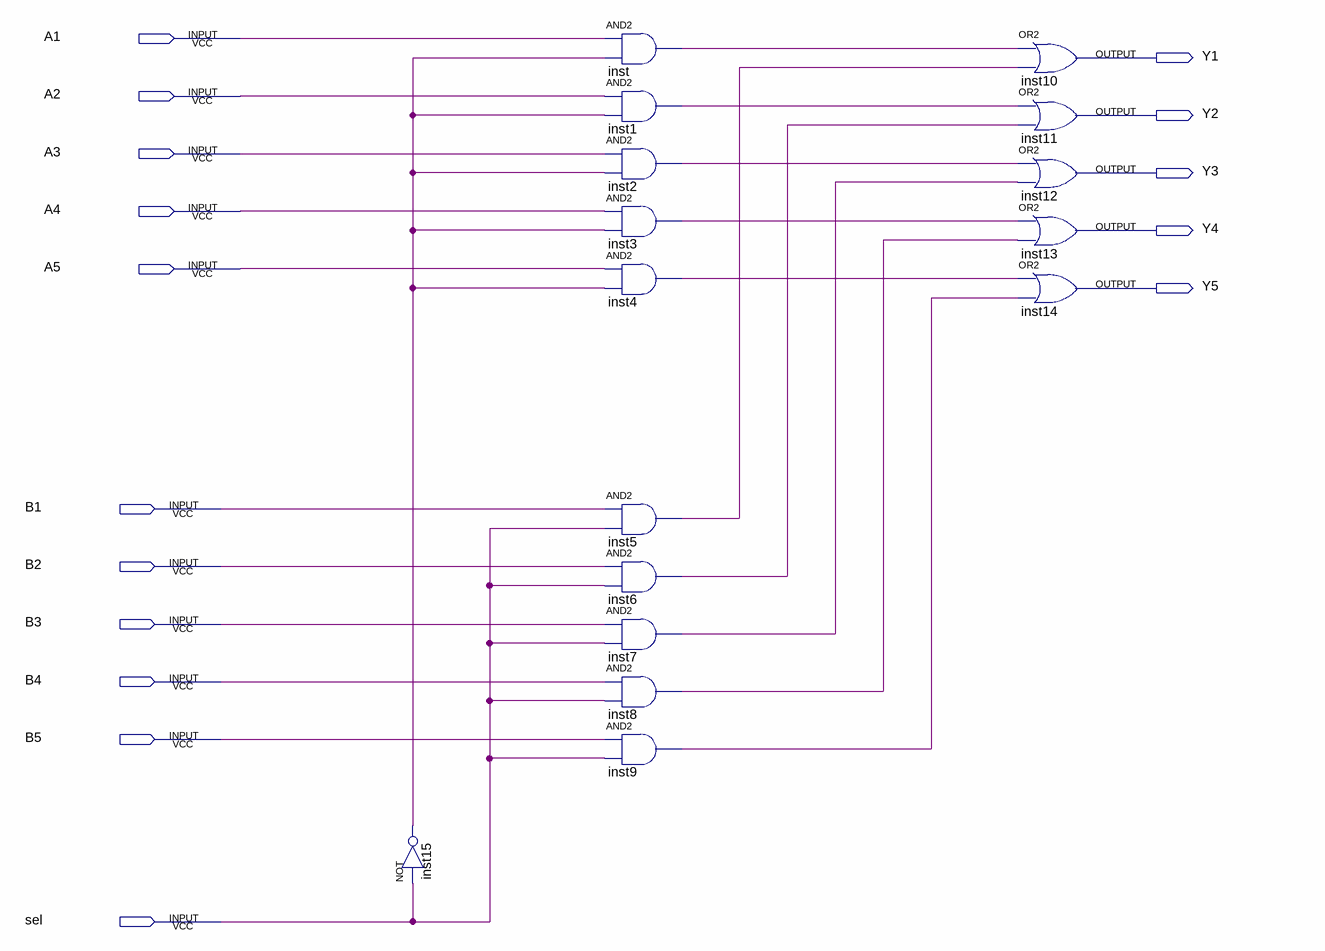
[diagram p0: schematic sheet]
// Quartus schematic 10sel5.bdf as structural Verilog: 16 symbols, 16 pins
module \10sel5  (
  input  A1,
  input  A2,
  input  A3,
  input  A4,
  input  A5,
  input  B1,
  input  B2,
  input  B3,
  input  B4,
  input  B5,
  input  sel,
  output Y1,
  output Y2,
  output Y3,
  output Y4,
  output Y5
);

  wire inst1_out, inst2_out, inst3_out, inst4_out, inst5_out, inst6_out, inst7_out, inst8_out, inst9_out,
       inst15_out, inst_out;

  not inst15 (inst15_out, sel);
  and inst (inst_out, A1, inst15_out);
  and inst1 (inst1_out, A2, inst15_out);
  and inst2 (inst2_out, A3, inst15_out);
  and inst3 (inst3_out, A4, inst15_out);
  and inst4 (inst4_out, A5, inst15_out);
  and inst5 (inst5_out, B1, sel);
  and inst6 (inst6_out, B2, sel);
  and inst7 (inst7_out, B3, sel);
  and inst8 (inst8_out, B4, sel);
  and inst9 (inst9_out, B5, sel);
  or inst10 (Y1, inst_out, inst5_out);
  or inst11 (Y2, inst1_out, inst6_out);
  or inst12 (Y3, inst2_out, inst7_out);
  or inst13 (Y4, inst3_out, inst8_out);
  or inst14 (Y5, inst4_out, inst9_out);
endmodule
